# EAGLE design SEV-Remote-Control (EAGLE 7.6.0)

## Sheet 1 of 4
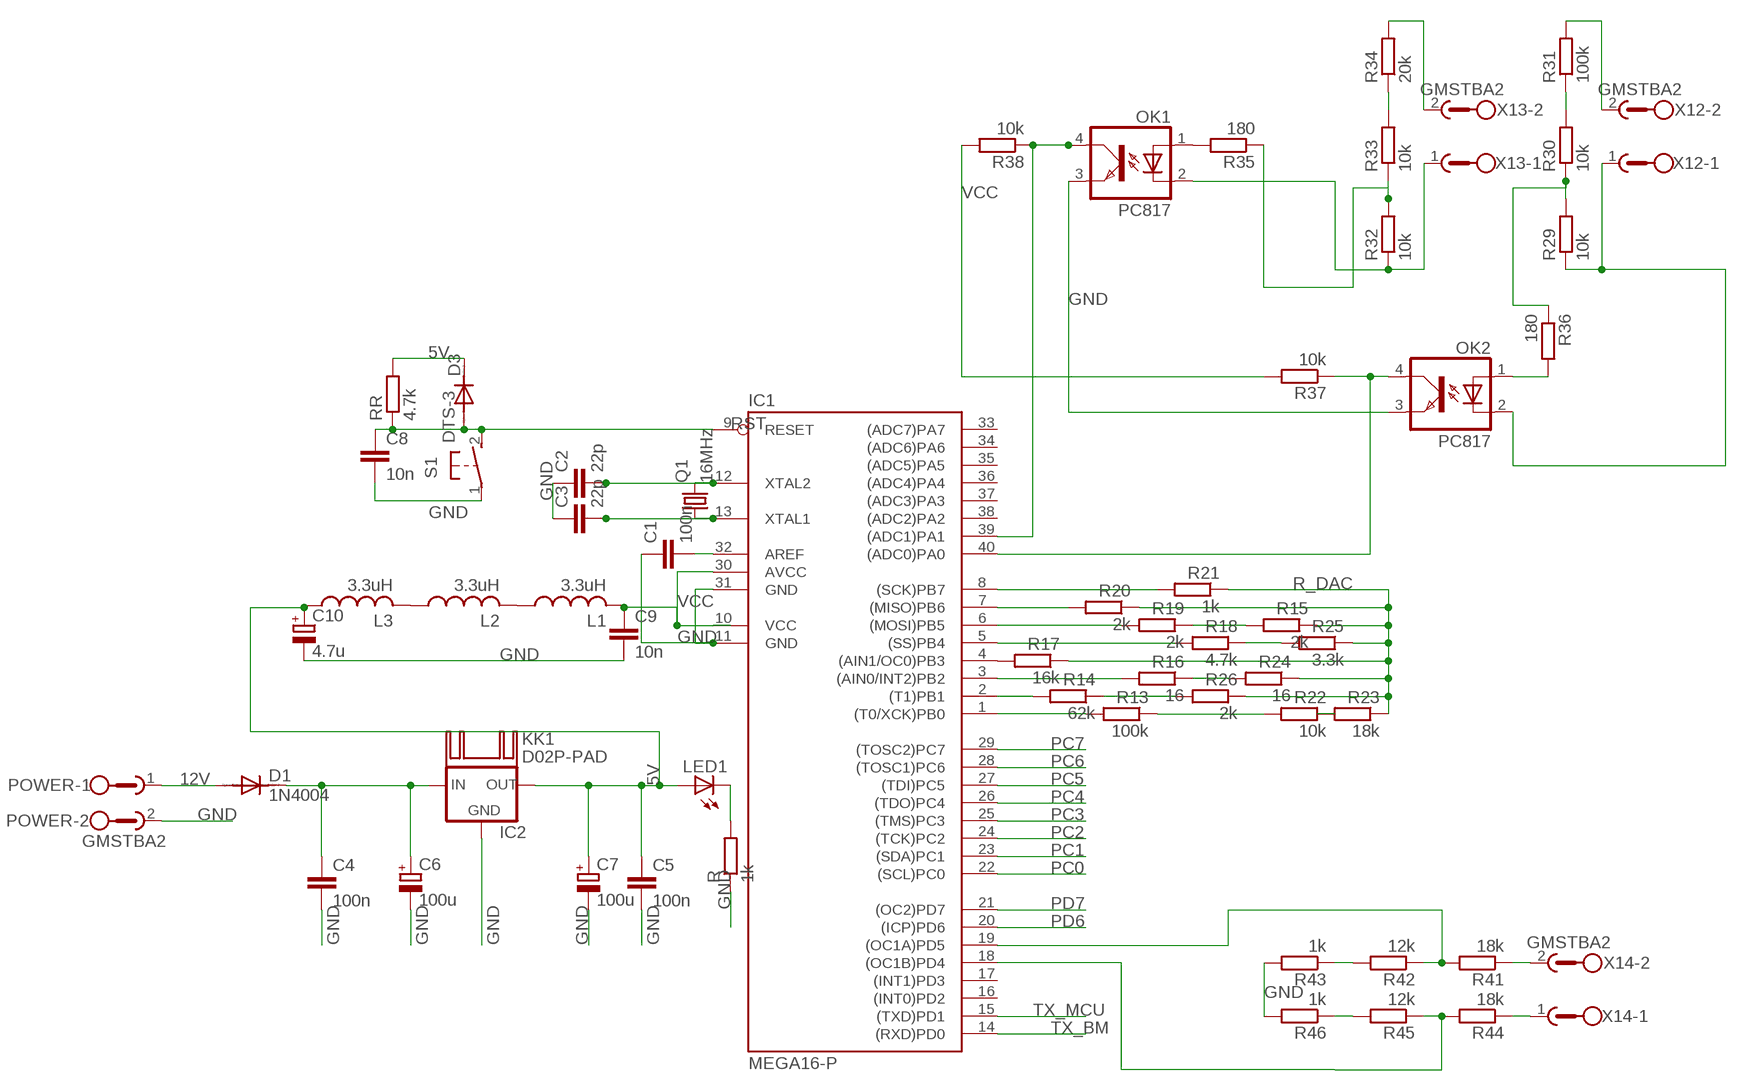
[diagram p0: schematic, sheet 1]

### Parts
C1  100n  C-EU025-025X050  [C025-025X050]
C2  22p  C-EU025-025X050  [C025-025X050]
C3  22p  C-EU025-025X050  [C025-025X050]
C4  100n  C-EU025-025X050  [C025-025X050]
C5  100n  C-EU025-025X050  [C025-025X050]
C6  100u  CPOL-EUE2.5-6  [E2,5-6]
C7  100u  CPOL-EUE2.5-6  [E2,5-6]
C8  10n  C-EU025-025X050  [C025-025X050]
C9  10n  C-EU025-025X050  [C025-025X050]
C10  4.7u  CPOL-EUE2.5-6  [E2,5-6]
D1  1N4004  [DO41-10]
D3  1N4148DO35-10  [DO35-10]
IC1  MEGA16-P  [DIL40]
IC2  78XXS  [78XXS]
KK1  D02P-PAD  [D02PA-PAD]
L1  3.3uH  L-US0207/7  [0207/7]
L2  3.3uH  L-US0207/7  [0207/7]
L3  3.3uH  L-US0207/7  [0207/7]
LED1  LED5MM  [LED5MM]
OK1  PC817  [DIL04]
OK2  PC817  [DIL04]
POWER  GMSTBA2  [GMSTBA2]
Q1  16MHz  CRYSTALHC49S  [HC49/S]
R  1k  R-EU_0207/10  [0207/10]
R13  100k  R-EU_0207/10  [0207/10]
R14  62k  R-EU_0207/10  [0207/10]
R15  2k  R-EU_0207/10  [0207/10]
R16  16  R-EU_0207/10  [0207/10]
R17  16k  R-EU_0207/10  [0207/10]
R18  4.7k  R-EU_0207/10  [0207/10]
R19  2k  R-EU_0207/10  [0207/10]
R20  2k  R-EU_0207/10  [0207/10]
R21  1k  R-EU_0207/10  [0207/10]
R22  10k  R-EU_0207/10  [0207/10]
R23  18k  R-EU_0207/10  [0207/10]
R24  16  R-EU_0207/10  [0207/10]
R25  3.3k  R-EU_0207/10  [0207/10]
R26  2k  R-EU_0207/10  [0207/10]
R29  10k  R-EU_0207/10  [0207/10]
R30  10k  R-EU_0207/10  [0207/10]
R31  100k  R-EU_0207/10  [0207/10]
R32  10k  R-EU_0207/10  [0207/10]
R33  10k  R-EU_0207/10  [0207/10]
R34  20k  R-EU_0207/10  [0207/10]
R35  180  R-EU_0207/10  [0207/10]
R36  180  R-EU_0207/10  [0207/10]
R37  10k  R-EU_0207/10  [0207/10]
R38  10k  R-EU_0207/10  [0207/10]
R41  18k  R-EU_0207/10  [0207/10]
R42  12k  R-EU_0207/10  [0207/10]
R43  1k  R-EU_0207/10  [0207/10]
R44  18k  R-EU_0207/10  [0207/10]
R45  12k  R-EU_0207/10  [0207/10]
R46  1k  R-EU_0207/10  [0207/10]
RR  4.7k  R-EU_0207/10  [0207/10]
S1  DTS-3  [DTS-3]
X12  GMSTBA2  [GMSTBA2]
X13  GMSTBA2  [GMSTBA2]
X14  GMSTBA2  [GMSTBA2]

### Nets
5V: C5.1 C7.+ C10.+ D3.C IC2.OUT L3.1 LED1.A RR.2
12V: D1.A POWER.1 ; also sheet 3
GND: C1.1 C2.1 C3.1 C4.2 C5.2 C6.- C7.- C8.2 C9.2 C10.- IC1.11(GND) IC1.31(GND) IC2.GND OK1.3(EMIT) OK2.3(EMIT) POWER.2 R43.2 R46.2 R.1 S1.1 ; also sheet 2,3,4
IN: C4.1 C6.+ D1.C IC2.IN
N$3: R15.2 R19.1
N$6: R13.1 R22.2
N$8: LED1.K(C) R.2
N$9: C2.2 IC1.12(XTAL2) Q1.2
N$10: R22.1 R23.2
N$12: C1.2 IC1.32(AREF)
N$13: R16.1 R24.2
N$15: C3.2 IC1.13(XTAL1) Q1.1
N$16: R18.1 R25.2
N$18: R14.1 R26.2
N$20: L1.1 L2.2
N$22: L2.1 L3.2
N$43: R29.2 R30.1 R36.1
N$45: R30.2 R31.1
N$46: R31.2 X12.2
N$47: IC1.40((ADC0)PA0) OK2.4(COL) R37.1
N$49: OK1.1(A) R35.2
N$51: R33.2 R34.1
N$52: R34.2 X13.2
N$53: OK1.2(C) R32.1 X13.1
N$54: R32.2 R33.1 R35.1
N$55: OK2.1(A) R36.2
N$56: IC1.2((T1)PB1) R14.2
N$57: OK2.2(C) R29.1 X12.1
N$58: IC1.39((ADC1)PA1) OK1.4(COL) R38.1
N$59: R44.1 X14.1
N$60: IC1.1((T0/XCK)PB0) R13.2
N$61: IC1.3((AIN0/INT2)PB2) R16.2
N$62: IC1.4((AIN1/OC0)PB3) R17.2
N$63: IC1.5((SS)PB4) R18.2
N$64: IC1.6((MOSI)PB5) R19.2
N$65: IC1.7((MISO)PB6) R20.2
N$66: IC1.8((SCK)PB7) R21.2
N$67: R41.1 X14.2
N$69: IC1.19((OC1A)PD5) R41.2 R42.1
N$71: IC1.18((OC1B)PD4) R44.2 R45.1
N$72: R42.2 R43.1
N$73: R45.2 R46.1
PC0: IC1.22((SCL)PC0) ; also sheet 3
PC1: IC1.23((SDA)PC1) ; also sheet 3
PC2: IC1.24((TCK)PC2) ; also sheet 3
PC3: IC1.25((TMS)PC3) ; also sheet 3
PC4: IC1.26((TDO)PC4) ; also sheet 3
PC5: IC1.27((TDI)PC5) ; also sheet 3
PC6: IC1.28((TOSC1)PC6) ; also sheet 3
PC7: IC1.29((TOSC2)PC7) ; also sheet 3
PD6: IC1.20((ICP)PD6) ; also sheet 3
PD7: IC1.21((OC2)PD7) ; also sheet 3
R_DAC: R15.1 R17.1 R20.1 R21.1 R23.1 R24.1 R25.1 R26.1 ; also sheet 2
RST: C8.1 D3.A IC1.9(RESET) RR.1 S1.2
TX_BM: IC1.14((RXD)PD0) ; also sheet 4
TX_MCU: IC1.15((TXD)PD1) ; also sheet 4
VCC: C9.1 IC1.10(VCC) IC1.30(AVCC) L1.2 R37.2 R38.2 ; also sheet 4
Unconnected: IC1.16((INT0)PD2) IC1.17((INT1)PD3) IC1.33((ADC7)PA7) IC1.34((ADC6)PA6) IC1.35((ADC5)PA5) IC1.36((ADC4)PA4) IC1.37((ADC3)PA3) IC1.38((ADC2)PA2) KK1.B(K)

## Sheet 2 of 4
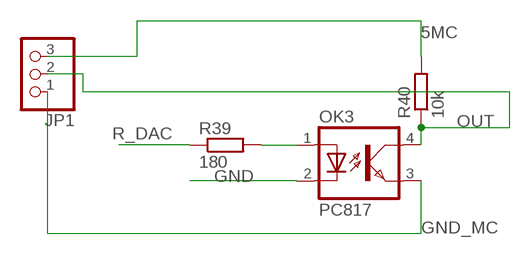
[diagram p1: schematic, sheet 2]

### Parts
JP1  PINHD-1X3  [1X03]
OK3  PC817  [DIL04]
R39  180  R-EU_0207/10  [0207/10]
R40  10k  R-EU_0207/10  [0207/10]

### Nets
5MC: JP1.3 R40.2
GND: OK3.2(C) ; also sheet 1,3,4
GND_MC: JP1.1 OK3.3(EMIT)
N$24: OK3.1(A) R39.2
OUT: JP1.2 OK3.4(COL) R40.1
R_DAC: R39.1 ; also sheet 1

## Sheet 3 of 4
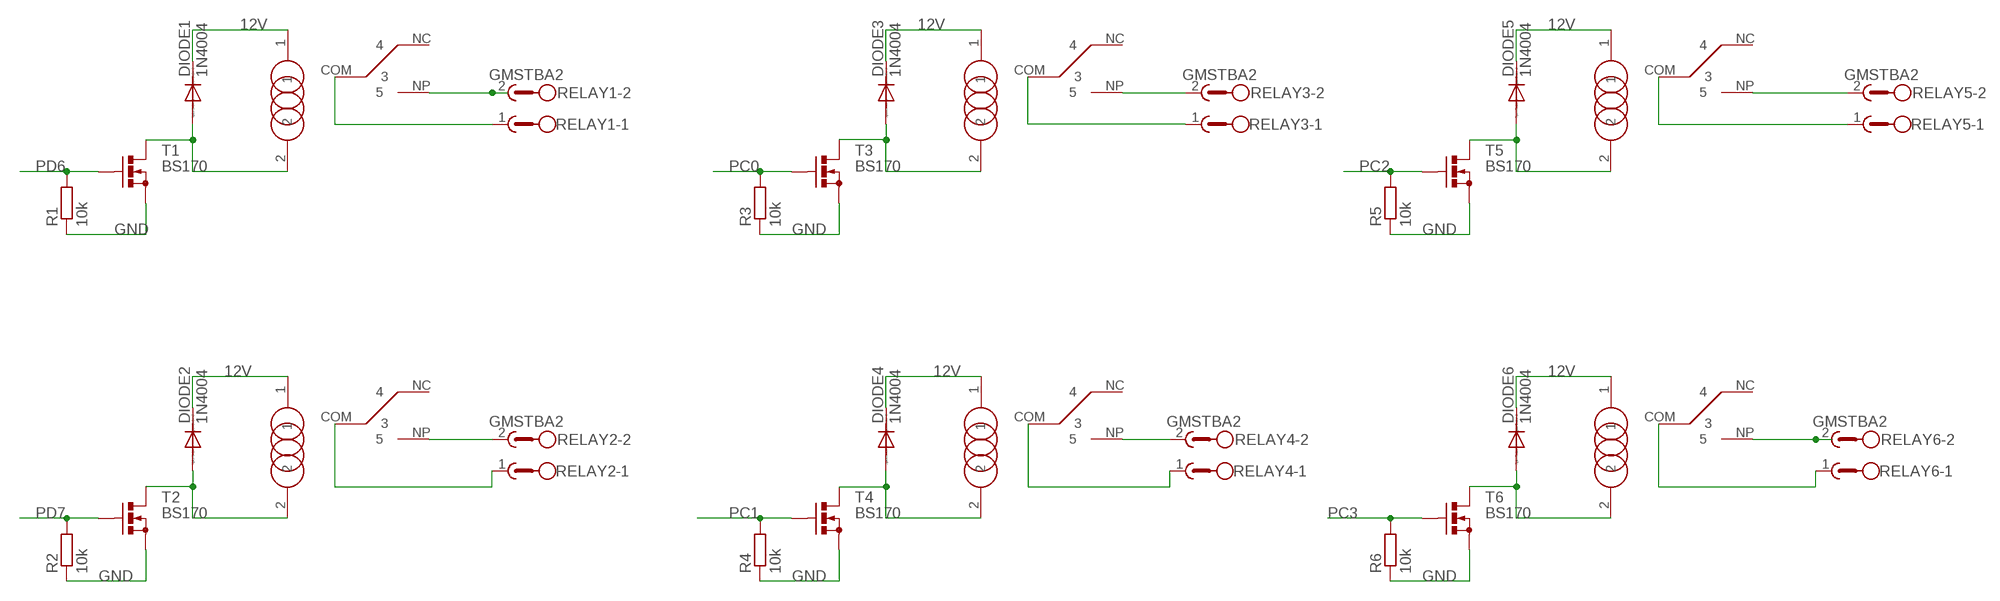
[diagram p2: schematic, sheet 3, part 1 of 2]
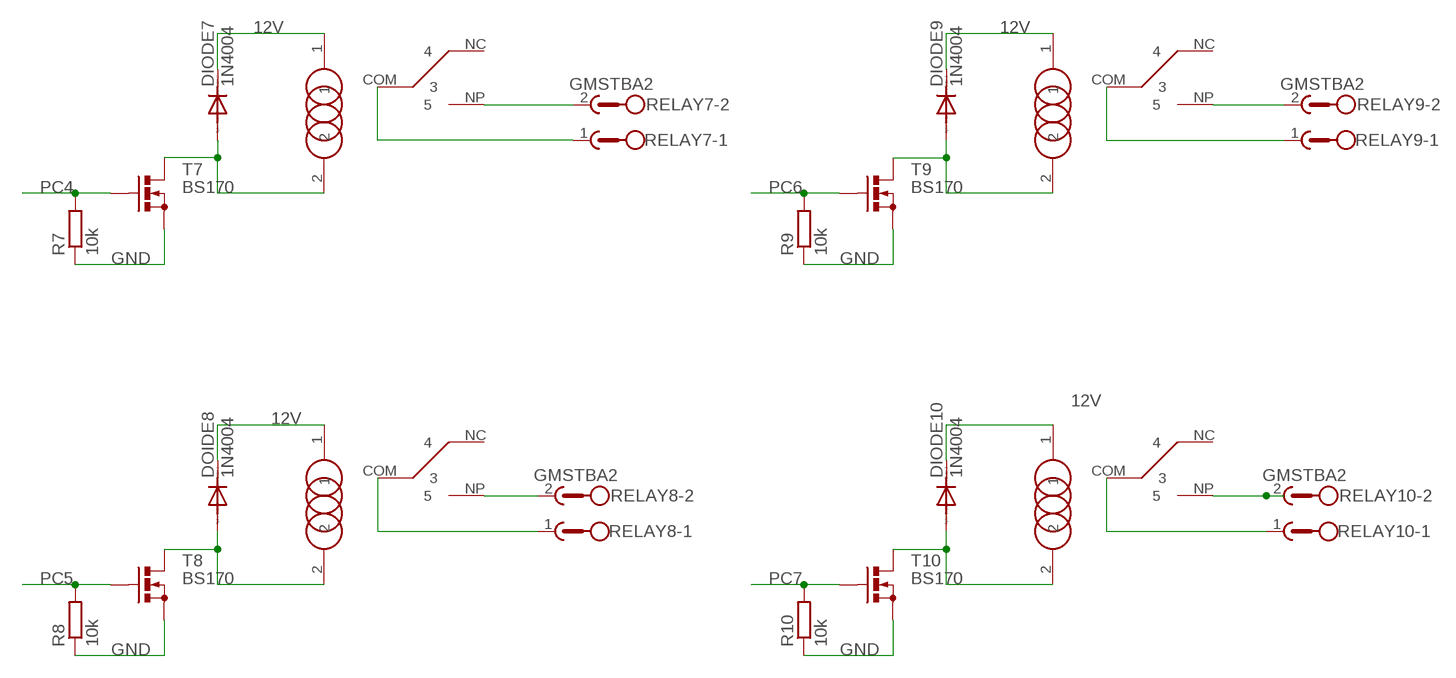
[diagram p3: schematic, sheet 3, part 2 of 2]

### Parts
DIODE1  1N4004  [DO41-10]
DIODE2  1N4004  [DO41-10]
DIODE3  1N4004  [DO41-10]
DIODE4  1N4004  [DO41-10]
DIODE5  1N4004  [DO41-10]
DIODE6  1N4004  [DO41-10]
DIODE7  1N4004  [DO41-10]
DIODE9  1N4004  [DO41-10]
DIODE10  1N4004  [DO41-10]
DOIDE8  1N4004  [DO41-10]
R1  10k  R-EU_0207/10  [0207/10]
R2  10k  R-EU_0207/10  [0207/10]
R3  10k  R-EU_0207/10  [0207/10]
R4  10k  R-EU_0207/10  [0207/10]
R5  10k  R-EU_0207/10  [0207/10]
R6  10k  R-EU_0207/10  [0207/10]
R7  10k  R-EU_0207/10  [0207/10]
R8  10k  R-EU_0207/10  [0207/10]
R9  10k  R-EU_0207/10  [0207/10]
R10  10k  R-EU_0207/10  [0207/10]
REL3  RELAY  [RELAY]
RELAY1  GMSTBA2  [GMSTBA2]
RELAY2  GMSTBA2  [GMSTBA2]
RELAY3  GMSTBA2  [GMSTBA2]
RELAY4  GMSTBA2  [GMSTBA2]
RELAY5  GMSTBA2  [GMSTBA2]
RELAY6  GMSTBA2  [GMSTBA2]
RELAY7  GMSTBA2  [GMSTBA2]
RELAY8  GMSTBA2  [GMSTBA2]
RELAY9  GMSTBA2  [GMSTBA2]
RELAY10  GMSTBA2  [GMSTBA2]
T1  BS170  [SOT54E]
T2  BS170  [SOT54E]
T3  BS170  [SOT54E]
T4  BS170  [SOT54E]
T5  BS170  [SOT54E]
T6  BS170  [SOT54E]
T7  BS170  [SOT54E]
T8  BS170  [SOT54E]
T9  BS170  [SOT54E]
T10  BS170  [SOT54E]
U$1  RELAY  [RELAY]
U$2  RELAY  [RELAY]
U$3  RELAY  [RELAY]
U$5  RELAY  [RELAY]
U$6  RELAY  [RELAY]
U$7  RELAY  [RELAY]
U$8  RELAY  [RELAY]
U$9  RELAY  [RELAY]
U$10  RELAY  [RELAY]

### Nets
12V: DIODE1.C DIODE2.C DIODE3.C DIODE4.C DIODE5.C DIODE6.C DIODE7.C DIODE9.C DIODE10.C DOIDE8.C REL3.1 U$1.1 U$2.1 U$3.1 U$5.1 U$6.1 U$7.1 U$8.1 U$9.1 U$10.1 ; also sheet 1
COM: RELAY10.1 U$3.COM
COM1: RELAY2.1 U$9.COM
GND: R1.1 R2.1 R3.1 R4.1 R5.1 R6.1 R7.1 R8.1 R9.1 R10.1 T1.S T2.S T3.S T4.S T5.S T6.S T7.S T8.S T9.S T10.S ; also sheet 1,2,4
N$1: REL3.COM RELAY3.1
N$4: DIODE3.A REL3.2 T3.D
N$5: RELAY8.1 U$1.COM
N$7: DOIDE8.A T8.D U$1.2
N$11: DIODE9.A T9.D U$2.2
N$14: RELAY9.2 U$2.NP
N$17: RELAY6.2 U$8.NP
N$19: DIODE10.A T10.D U$3.2
N$23: DIODE6.A T6.D U$8.2
N$26: DIODE2.A T2.D U$9.2
N$27: RELAY7.2 U$10.NP
N$28: REL3.NP RELAY3.2
N$29: DIODE7.A T7.D U$10.2
N$31: RELAY4.1 U$5.COM
N$32: DIODE4.A T4.D U$5.2
N$33: RELAY9.1 U$2.COM
N$34: RELAY5.1 U$6.COM
N$35: RELAY8.2 U$1.NP
N$36: RELAY4.2 U$5.NP
N$38: RELAY6.1 U$8.COM
N$39: RELAY1.1 U$7.COM
N$40: RELAY7.1 U$10.COM
N$42: DIODE5.A T5.D U$6.2
N$44: RELAY5.2 U$6.NP
N$48: DIODE1.A T1.D U$7.2
N$50: RELAY1.2 U$7.NP
NP1: RELAY2.2 U$9.NP
PC0: R3.2 T3.G ; also sheet 1
PC1: R4.2 T4.G ; also sheet 1
PC2: R5.2 T5.G ; also sheet 1
PC3: R6.2 T6.G ; also sheet 1
PC4: R7.2 T7.G ; also sheet 1
PC5: R8.2 T8.G ; also sheet 1
PC6: R9.2 T9.G ; also sheet 1
PC7: R10.2 T10.G ; also sheet 1
PD6: R1.2 T1.G ; also sheet 1
PD7: R2.2 T2.G ; also sheet 1
RELAY6: RELAY10.2 U$3.NP
Unconnected: REL3.NC U$1.NC U$2.NC U$3.NC U$5.NC U$6.NC U$7.NC U$8.NC U$9.NC U$10.NC

## Sheet 4 of 4
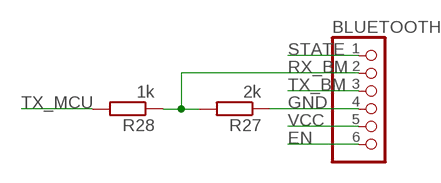
[diagram p4: schematic, sheet 4]

### Parts
BLUETOOTH  PINHD-1X6  [1X06]
R27  2k  R-EU_0207/10  [0207/10]
R28  1k  R-EU_0207/10  [0207/10]

### Nets
EN: BLUETOOTH.6
GND: BLUETOOTH.4 R27.1 ; also sheet 1,2,3
RX_BM: BLUETOOTH.2 R27.2 R28.1
STATE: BLUETOOTH.1
TX_BM: BLUETOOTH.3 ; also sheet 1
TX_MCU: R28.2 ; also sheet 1
VCC: BLUETOOTH.5 ; also sheet 1

## Library data of the parts
BLUETOOTH = pinhead:PINHD-1X6: PIN HEADER
C1-C5 C8 C9 = rcl:C-EU: CAPACITOR, European symbol
C6 C7 C10 = rcl:CPOL-EU: POLARIZED CAPACITOR, European symbol
D1 DIODE1-DIODE7 DIODE9 DIODE10 DOIDE8 = diode:1N4004: DIODE general purpose rectifier, 1 A
D3 = diode:1N4148: DIODE high speed (Philips)
IC1 = atmel:MEGA16-P: MICROCONTROLLER 16 Kbytes FLASH 1 kbytes SRAM 512 bytes EEPROM USART 8-channel 10 bit ADC Source: avr.lbr; MPN: ATMEGA16-16PU; OC_FARNELL: 9171142; OC_NEWARK: 01M6885
IC2 = v-reg:78XXS: VOLTAGE REGULATOR
JP1 = pinhead:PINHD-1X3: PIN HEADER
KK1 = heatsink:D02P-PAD: HEATSINK distributor Schukat
L1-L3 = rcl:L-US: INDUCTOR, American symbol
LED1 = led:LED: LED OSRAM: - CHIPLED LG R971, LG N971, LY N971, LG Q971, LY Q971, LO R971, LY R971 LH N974, LH R974 LS Q976, LO Q976, LY Q976 LO Q996 - Hyper CHIPLED LW Q18S LB Q993, LB Q99A, LB R99A - SideLED LS A670, LO A670, LY A670, LG A670, LP A670 LB A673, LV A673, LT A673, LW A673 LH A674 LY A675 LS A676, LA A676, LO A676, LY A676, LW A676 LS A679, LY A679, LG A679 - Hyper Micro SIDELED® LS Y876, LA Y876, LO Y876, LY Y876 LT Y87S - SmartLED LW L88C, LW L88S LB L89C, LB L89S, LG L890 LS L89K, LO L89K, LY L89K LS L896, LA L896, LO L896, LY L896 - TOPLED LS T670, LO T670, LY T670, LG T670, LP T670 LSG T670, LSP T670, LSY T670, LOP T670, LYG T670 LG T671, LOG T671, LSG T671 LB T673, LV T673, LT T673, LW T673 LH T674 LS T676, LA T676, LO T676, LY T676, LB T676, LH T676, LSB T676, LW T676 LB T67C, LV T67C, LT T67C, LS T67K, LO T67K, LY T67K, LW E67C LS E67B, LA E67B, LO E67B, LY E67B, LB E67C, LV E67C, LT E67C LW T67C LS T679, LY T679, LG T679 LS T770, LO T770, LY T770, LG T770, LP T770 LB T773, LV T773, LT T773, LW T773 LH T774 LS E675, LA E675, LY E675, LS T675 LS T776, LA T776, LO T776, LY T776, LB T776 LHGB T686 LT T68C, LB T68C - Hyper Mini TOPLED® LB M676 - Mini TOPLED Santana® LG M470 LS M47K, LO M47K, LY M47K Source: http://www.osram.convergy.de LUXEON: - LUMILED® LXK2-PW12-R00, LXK2-PW12-S00, LXK2-PW14-U00, LXK2-PW14-V00 LXK2-PM12-R00, LXK2-PM12-S00, LXK2-PM14-U00 LXK2-PE12-Q00, LXK2-PE12-R00, LXK2-PE12-S00, LXK2-PE14-T00, LXK2-PE14-U00 LXK2-PB12-K00, LXK2-PB12-L00, LXK2-PB12-M00, LXK2-PB14-N00, LXK2-PB14-P00, LXK2-PB14-Q00 LXK2-PR12-L00, LXK2-PR12-M00, LXK2-PR14-Q00, LXK2-PR14-R00 LXK2-PD12-Q00, LXK2-PD12-R00, LXK2-PD12-S00 LXK2-PH12-R00, LXK2-PH12-S00 LXK2-PL12-P00, LXK2-PL12-Q00, LXK2-PL12-R00 Source: www.luxeon.com KINGBRIGHT: KA-3528ASYC Source: www.kingbright.com
OK1-OK3 = optocoupler:PC817: SHARP OPTO COUPLER; MPN: PC817X4J000F; OC_FARNELL: 9707727; OC_NEWARK: 97K7059
POWER RELAY1-RELAY10 X12-X14 = con-phoenix-762:GMSTBA2: PHOENIX; MF: FARNELL; MPN: 1757242; OC_FARNELL: 3705171; OC_NEWARK: 71C4161
Q1 = crystal:CRYSTAL: CRYSTAL; OC_FARNELL: 1667008; OC_NEWARK: unknown
R R1-R10 R13-R46 RR = rcl:R-EU_: RESISTOR, European symbol
REL3 U$1-U$3 U$5-U$10 = relaye:RELAY
S1 = switch-tact:DTS-3
T1-T10 = transistor-small-signal:BS170: N-CHANNEL MOS FET

## Net classes
0 default: width 1.676 mm, clearance 0.305 mm

## Board
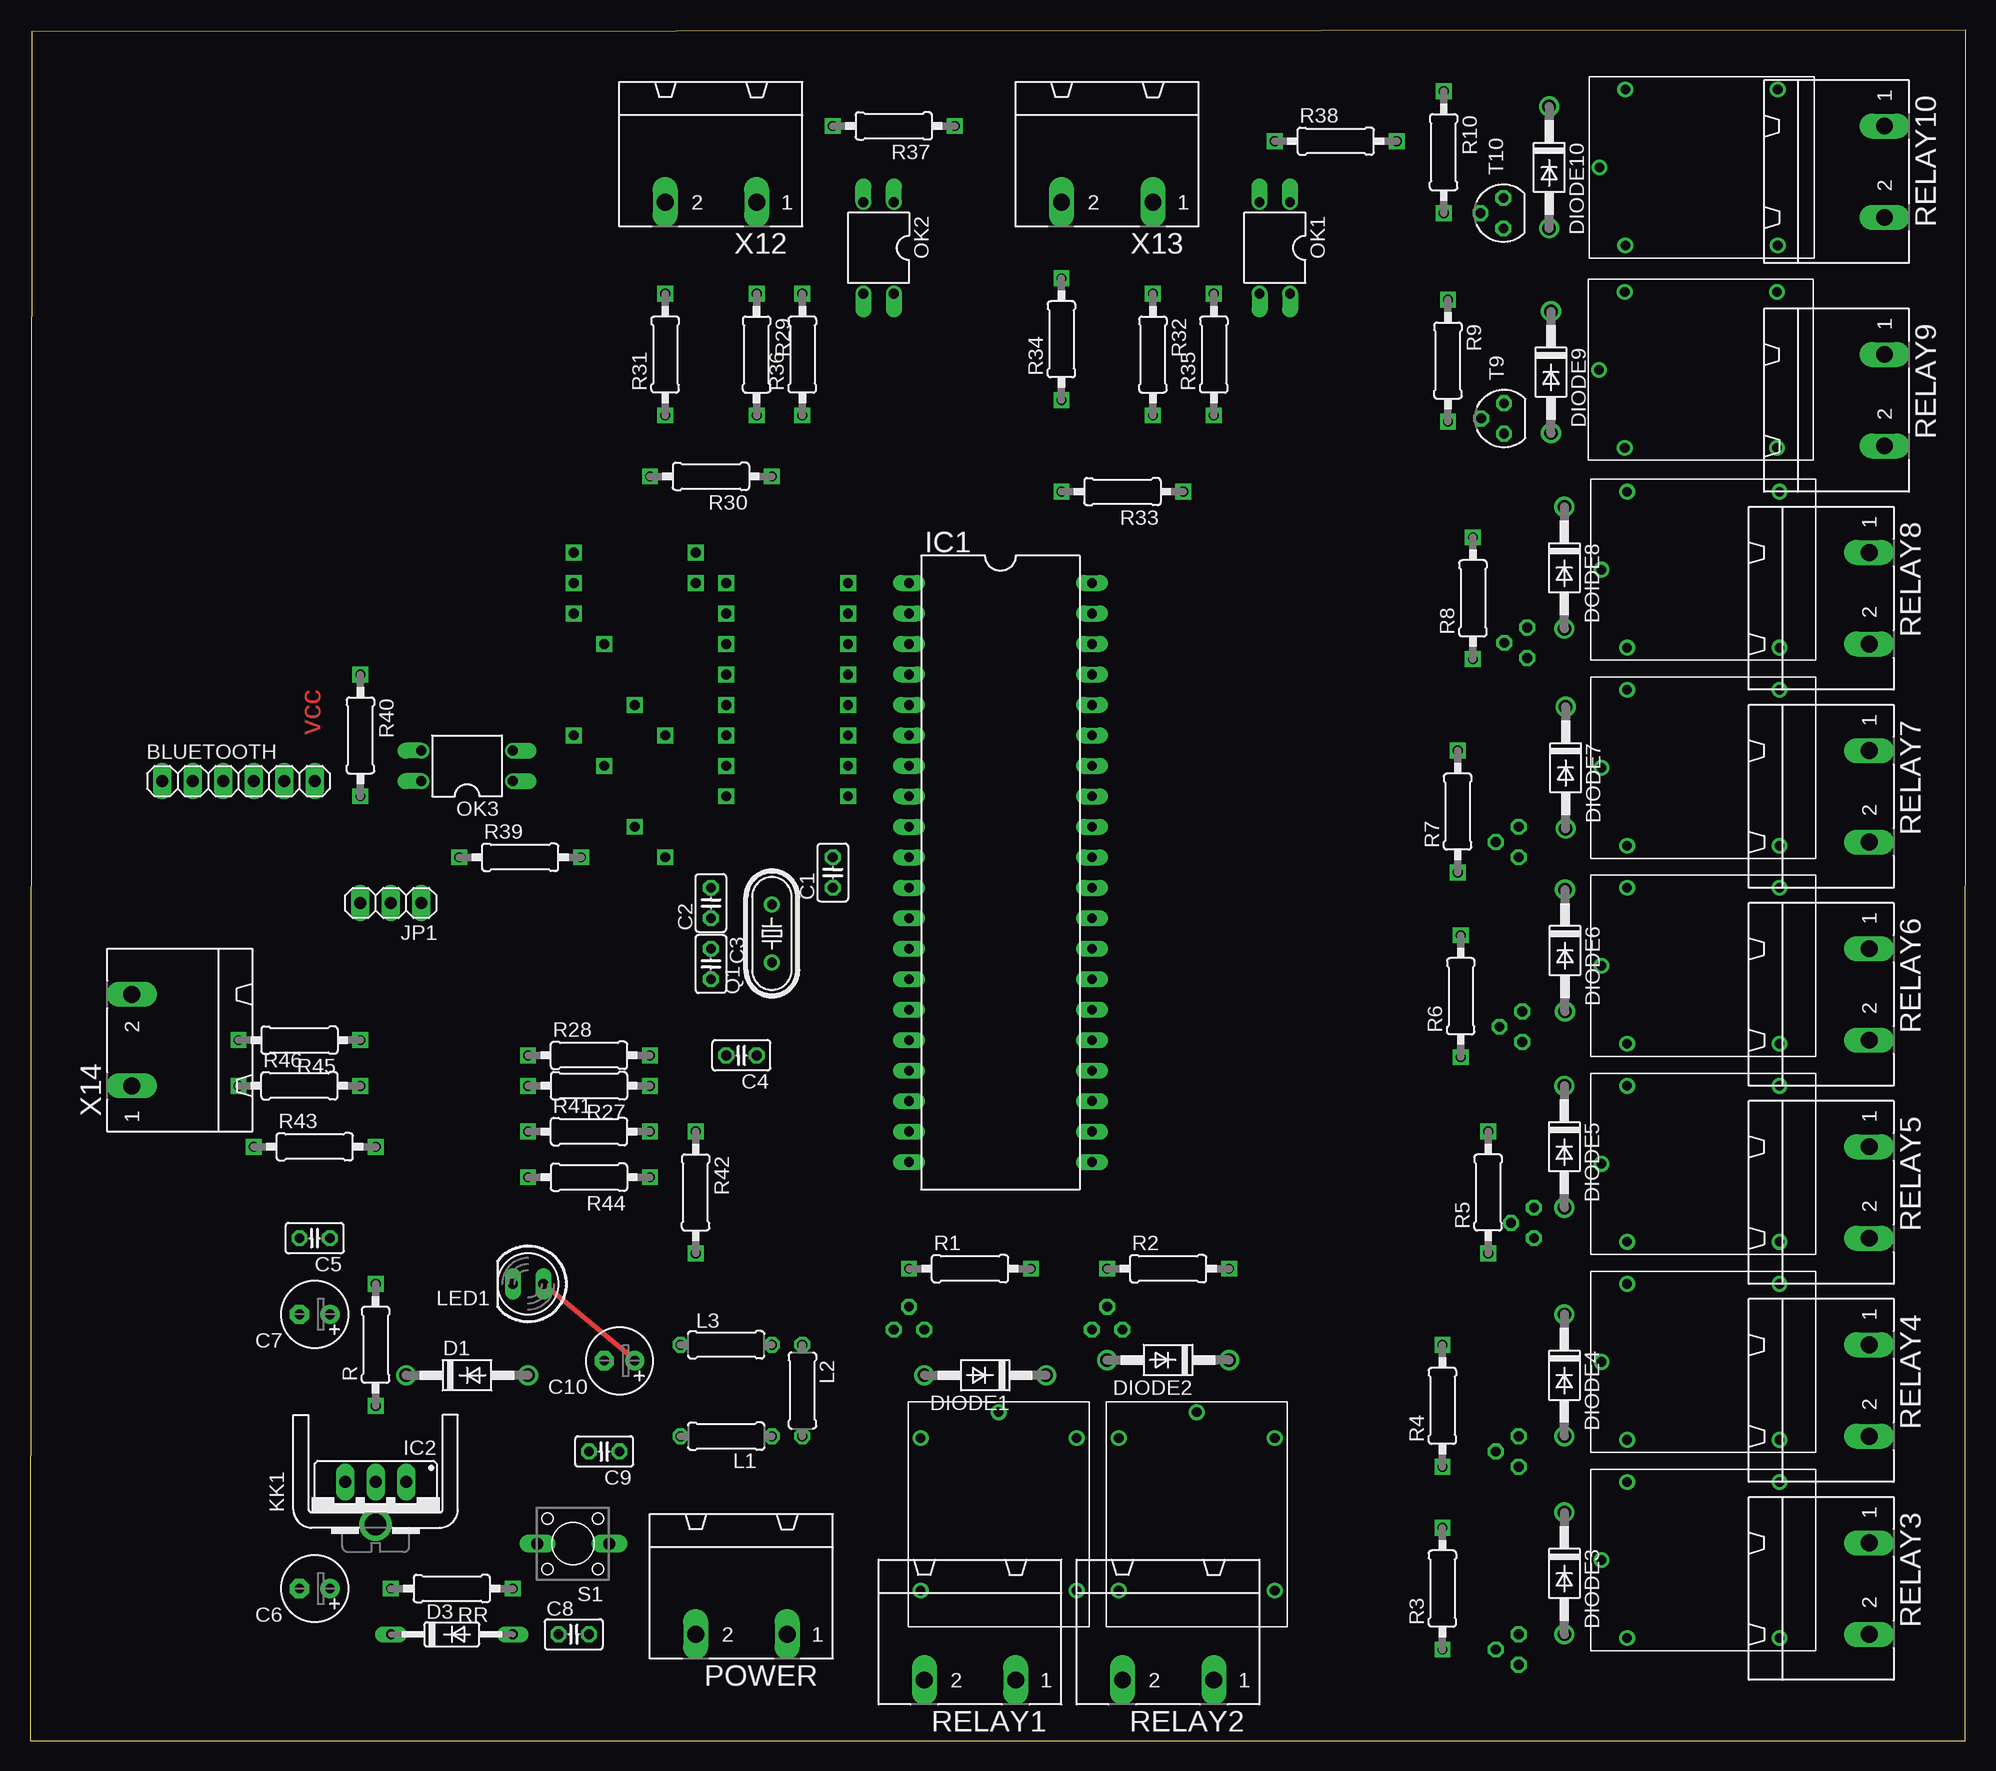
[diagram p5: board, top side]
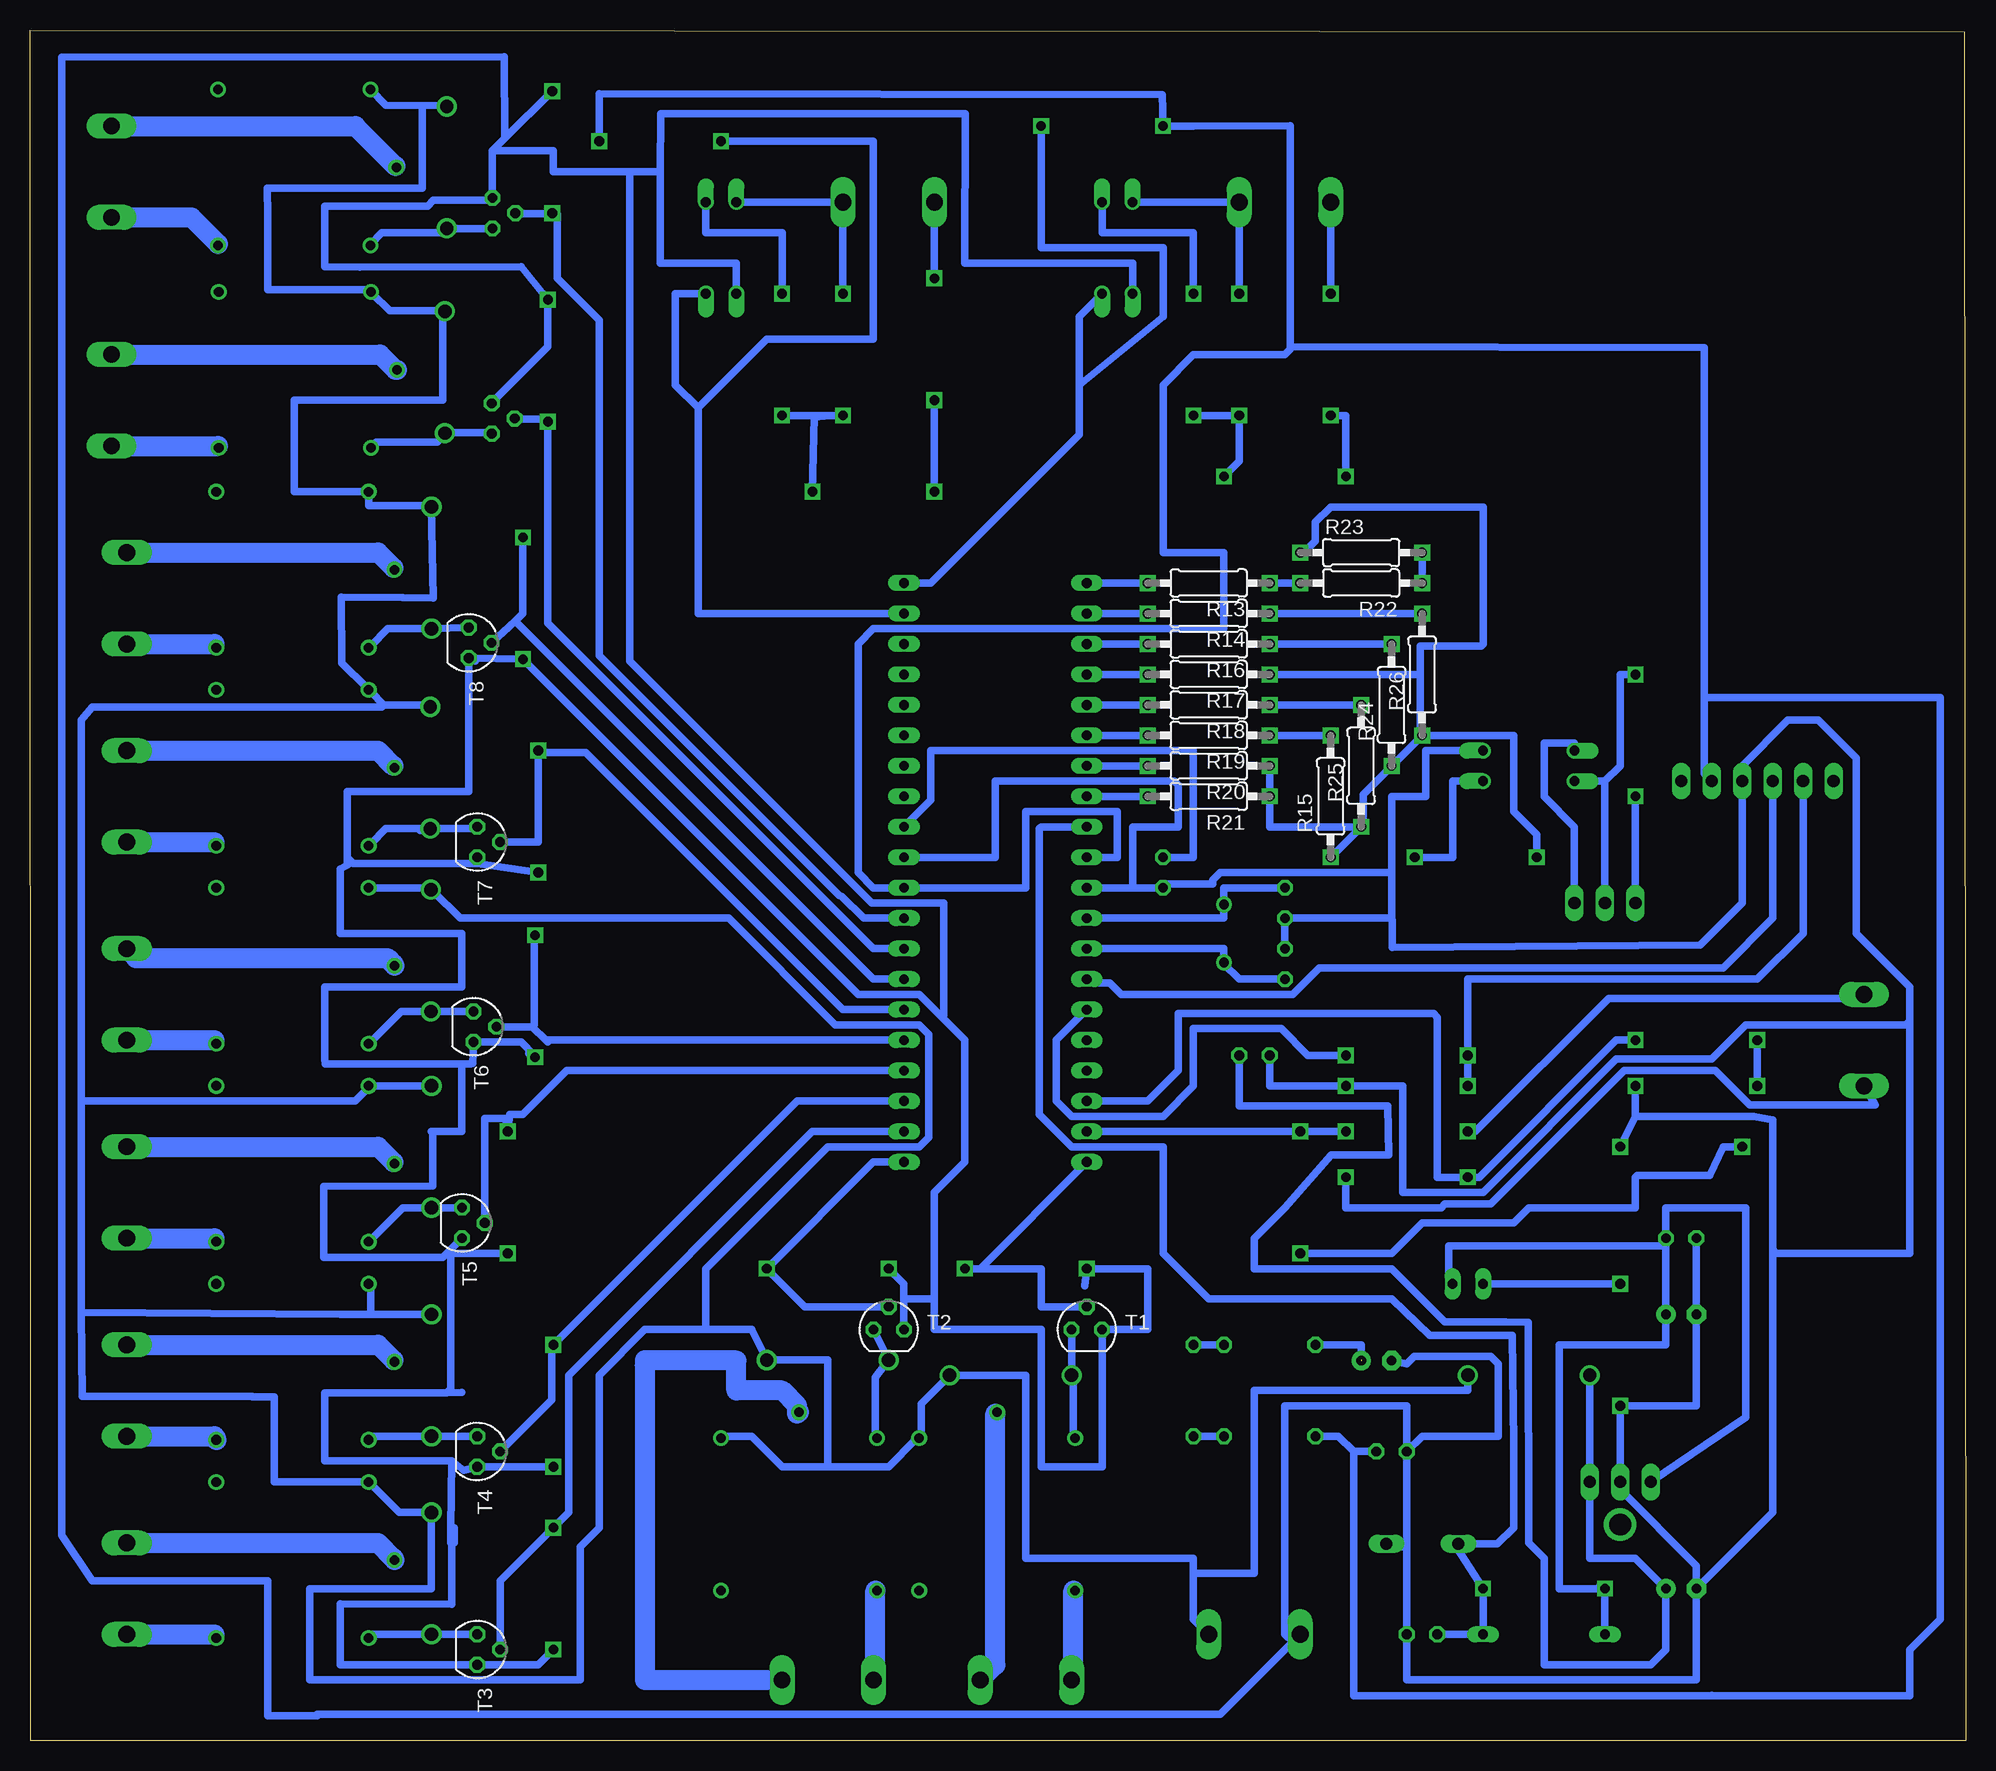
[diagram p6: board, bottom side, seen from below]

Size 161.32 x 142.62 mm. Coordinates in mm from the lower left corner, seen from the top.
Outline: 0,0 161.27,0 161.32,142.62 0.15,142.47 0,0
Copper layers (1*16): Top 0.035mm / dielectric 1.5mm / Bottom 0.035mm
Design rules "default": minimum track width 10mil, minimum drill 24mil, track to track 8mil, track to pad 8mil, pad to pad 8mil, via to via 8mil, smd to smd 8mil, copper to edge 40mil, drill to drill 8mil, minimum pad ring 10mil, minimum via ring 8mil, stop-mask expansion 4mil, vias tented up to drill 0mil, thermal gap 10mil

### Footprints (pad centres in the part's own frame; a part is rotated, then mirrored left to right if it is on the bottom)
1X06 = drill 1.016 long: 1 -6.35,0; 2 -3.81,0; 3 -1.27,0; 4 1.27,0; 5 3.81,0; 6 6.35,0
C025-025X050 = drill 0.813 octagon: 1 -1.27,0; 2 1.27,0
E2,5-6 = drill 0.813 pad 1.6: + -1.27,0 | drill 0.813 pad 1.6 octagon: - 1.27,0
DO41-10 = drill 1.118: A 5.08,0; C -5.08,0
DO35-10 = drill 0.813 long: A 5.08,0; C -5.08,0
DIL40 = drill 0.813 long: 1 -24.13,-7.62; 2 -21.59,-7.62; 3 -19.05,-7.62; 4 -16.51,-7.62; 5 -13.97,-7.62; 6 -11.43,-7.62; 7 -8.89,-7.62; 8 -6.35,-7.62; 9 -3.81,-7.62; 10 -1.27,-7.62; 11 1.27,-7.62; 12 3.81,-7.62; 13 6.35,-7.62; 14 8.89,-7.62; 15 11.43,-7.62; 16 13.97,-7.62; 17 16.51,-7.62; 18 19.05,-7.62; 19 21.59,-7.62; 20 24.13,-7.62; 21 24.13,7.62; 22 21.59,7.62; 23 19.05,7.62; 24 16.51,7.62; 25 13.97,7.62; 26 11.43,7.62; 27 8.89,7.62; 28 6.35,7.62; 29 3.81,7.62; 30 1.27,7.62; 31 -1.27,7.62; 32 -3.81,7.62; 33 -6.35,7.62; 34 -8.89,7.62; 35 -11.43,7.62; 36 -13.97,7.62; 37 -16.51,7.62; 38 -19.05,7.62; 39 -21.59,7.62; 40 -24.13,7.62
78XXS = drill 1.016 long: GND 0,-2.54; IN -2.54,-2.54; OUT 2.54,-2.54
1X03 = drill 1.016 long: 1 -2.54,0; 2 0,0; 3 2.54,0
D02PA-PAD = drill 1.803 pad 2.54: B 0,-1.016
0207/7 = drill 0.813 octagon: 1 -3.81,0; 2 3.81,0
LED5MM = drill 0.813 long: A -1.27,0; K 1.27,0
DIL04 = drill 0.813 offset: 1 -1.27,-3.81; 2 1.27,-3.81; 3 1.27,3.81; 4 -1.27,3.81
GMSTBA2 = drill 1.397 long: 1 -3.81,5.08; 2 3.81,5.08
HC49/S = drill 0.813: 1 -2.413,0; 2 2.413,0
0207/10 = drill 0.813 square: 1 -5.08,0; 2 5.08,0
RELAY = drill 0.8: 1 -6.35,6.5; 2 -6.35,-6.5; COM -8.5,0; NC 6.35,6.5; NP 6.35,-6.5
DTS-3 = drill 1 long: 1 -2.971,0.075; 2 3.029,0.075
SOT54E = drill 0.813 octagon: D -1.27,0; G 0,1.905; S 1.27,0

### Placement (x,y rotation side)
BLUETOOTH  17.37,80.01 0 top
C1  66.9,72.39 90 top
C2  56.74,69.85 90 top
C3  56.74,64.77 270 top
C4  59.28,57.15 180 top
C5  23.72,41.91 180 top
C6  23.72,12.7 180 top
C7  23.72,35.56 180 top
C8  45.31,8.89 0 top
C9  47.85,24.13 180 top
C10  49.12,31.7 180 top
D1  36.42,30.48 0 top
D3  35.15,8.89 0 top
DIODE1  79.6,30.48 180 top
DIODE2  94.84,31.75 180 top
DIODE3  127.86,13.97 270 top
DIODE4  127.86,30.48 270 top
DIODE5  127.86,49.53 270 top
DIODE6  127.91,65.89 270 top
DIODE7  127.97,81.13 270 top
DIODE9  126.75,114.1 270 top
DIODE10  126.59,131.17 270 top
DOIDE8  127.86,97.79 270 top
IC1  80.87,72.39 270 top
IC2  28.8,19.05 180 top
JP1  30.07,69.85 180 top
KK1  28.8,19.05 0 top
L1  58.01,25.4 180 top
L2  64.36,29.21 270 top
L3  58.01,33.02 0 top
LED1  41.5,38.1 180 top
OK1  103.73,124.46 180 top
OK2  70.71,124.46 180 top
OK3  36.42,81.28 90 top
POWER  59.28,13.97 180 top
Q1  61.82,67.31 90 top
R  28.8,33.02 90 top
R1  78.33,39.37 0 top
R2  94.84,39.37 0 top
R3  117.7,12.7 90 top
R4  117.7,27.94 90 top
R5  121.51,45.72 90 top
R6  119.23,62.08 90 top
R7  118.97,77.47 90 top
R8  120.24,95.25 90 top
R9  118.16,115.06 270 top
R10  117.81,132.44 270 top
R13  63.09,96.52 180 bottom
R14  63.09,93.98 180 bottom
R15  52.93,78.74 90 bottom
R16  63.09,91.44 180 bottom
R17  63.09,88.9 180 bottom
R18  63.09,86.36 180 bottom
R19  63.09,83.82 180 bottom
R20  63.09,81.28 180 bottom
R21  63.09,78.74 180 bottom
R22  50.39,96.52 180 bottom
R23  50.39,99.06 0 bottom
R24  47.85,86.36 90 bottom
R25  50.39,81.28 90 bottom
R26  45.31,88.9 90 bottom
R27  46.58,54.61 180 top
R28  46.58,57.15 0 top
R29  60.55,115.57 270 top
R30  56.74,105.41 180 top
R31  52.93,115.57 90 top
R32  93.57,115.57 270 top
R33  91.03,104.14 180 top
R34  85.95,116.84 90 top
R35  98.65,115.57 90 top
R36  64.36,115.57 90 top
R37  71.98,134.62 180 top
R38  108.81,133.35 0 top
R39  40.84,73.66 0 top
R40  27.53,83.82 270 top
R41  46.58,50.8 0 top
R42  55.47,45.72 270 top
R43  23.72,49.53 0 top
R44  46.58,46.99 180 top
R45  22.45,58.42 180 top
R46  22.45,54.61 0 top
REL3  139.45,15.09 0 top
RELAY1  78.33,10.16 180 top
RELAY2  94.84,10.16 180 top
RELAY3  148.18,12.7 270 top
RELAY4  148.18,29.21 270 top
RELAY5  148.18,45.72 270 top
RELAY6  148.18,62.23 270 top
RELAY7  148.18,78.74 270 top
RELAY8  148.18,95.25 270 top
RELAY9  149.45,111.76 270 top
RELAY10  149.45,130.81 270 top
RR  35.15,12.7 180 top
S1  45.31,16.51 180 top
T1  73.25,34.29 0 bottom
T2  89.76,34.29 0 bottom
T3  124.05,7.62 270 bottom
T4  124.05,24.13 270 bottom
T5  125.32,43.18 270 bottom
T6  124.36,59.54 270 bottom
T7  124.05,74.93 270 bottom
T8  124.76,91.54 270 bottom
T9  122.83,110.24 90 top
T10  122.78,127.36 90 top
U$1  139.45,97.64 0 top
U$2  139.24,114.3 0 top
U$3  139.29,131.17 0 top
U$5  139.45,31.6 0 top
U$6  139.45,48.11 0 top
U$7  80.72,18.9 270 top
U$8  139.45,64.62 0 top
U$9  97.23,18.9 270 top
U$10  139.45,81.13 0 top
X12  56.74,133.35 180 top
X13  89.76,133.35 180 top
X14  13.56,58.42 90 top

### Tracks (layer width: path | path; a pad name or v marks a point on that pad's centre or on a via)
5MC
  Bottom 0.61: R40.2 JP1.3 27.53,68.58
5V  (1 unrouted)
  Top 0.406: 50.39,31.75 LED1.A
  Bottom 0.61: D3.C RR.2 30.39,13.02 30.71,12.7 33.88,12.7 33.88,33.02 24.99,33.02 C7.+ 24.99,41.28 | 24.99,41.28 43.09,41.28 43.09,38.42 LED1.A | 24.99,41.28 C5.1 24.99,44.45 18.33,44.45 18.33,26.99 IC2.OUT | L3.1 50.39,33.02 C10.+
12V
  Bottom 0.61: DIODE5.C 132.94,54.61 U$6.1 | DIODE4.C 130.56,35.56 130.57,35.57 132.94,35.57 | 134.37,35.56 135.48,35.57 | 135.48,35.57 157.04,35.71 | 133.26,54.45 U$6.1 | 133.26,38.26 U$5.1 132.94,37.94 132.94,35.57 | 157.04,35.71 156.98,28.73 155.01,28.73 142.79,28.73 142.79,28.7 140.97,28.7 140.97,21.59 140.56,21.59 REL3.1 132.94,21.43 130.56,19.05 DIODE3.C 127.86,12.7 138.02,12.7 138.02,5.08 115.48,5.08 115.48,16.19 113.89,17.78 113.89,30.48 110.08,34.29 105,34.29 | 128.64,136.31 126.59,136.37 DIODE10.C | 128.64,136.31 131.67,136.37 132.94,137.64 U$3.1 | 126.91,119.22 126.75,119.22 DIODE9.C | 126.91,119.22 131.36,119.22 132.78,120.65 U$2.1 133.1,120.97 141.52,120.97 141.52,127.16 141.55,129.41 128.64,129.41 128.64,136.31 | 131.83,86.36 132.94,87.47 U$10.1 133.26,87.79 135.32,89.85 135.38,95.34 130.25,95.29 127.73,95.28 127.88,102.97 | 131.83,86.36 128.02,86.36 DIODE7.C | U$8.1 132.94,71.12 128.02,71.12 DIODE6.C 127.7,70.8 125.48,68.58 103.1,68.58 94.21,59.69 87.22,59.69 86.43,58.9 86.43,50.32 87.22,49.53 94.84,49.53 105,39.37 105,34.29 | 127.88,102.97 DOIDE8.C 127.7,102.71 | 132.94,103.98 U$1.1 | 126.91,119.22 126.91,111.76 139.29,111.76 139.29,104.14 U$1.1 | 133.26,104.3 U$1.1 | 131.83,86.36 131.99,86.2 156.12,86.2 157.04,85.08 157.04,53.34 | 103.57,25.4 U$9.1 103.58,25.4 101.19,25.4 98.65,22.86 94.84,22.86 | 127.88,102.97 133.1,102.97 U$1.1 | 157.04,35.71 157.04,53.34 | 157.04,53.34 134.21,53.34 133.26,54.29 U$6.1 | 105,34.29 101.19,34.29 DIODE2.C 94.84,31.75 94.84,22.86 | 94.84,22.86 89.76,22.86 87.54,25.08 87.38,25.08 U$7.1 87.06,25.4 87.06,28.1 DIODE1.C 78.33,30.48 78.33,15.24 64.36,15.24 64.36,13.97
  Bottom 0.61: 64.36,13.97 64.36,10.16 POWER.1 | 64.36,13.97 59.28,13.97 59.28,29.21 41.5,29.21 D1.A | 132.94,35.57 135.48,35.57 | 132.94,35.56 132.94,35.57
COM
  Bottom 0.61: 130.88,131.29 U$3.COM
  Bottom 1.676: 130.88,131.29 134.21,134.62 RELAY10.1
COM1
  Bottom 0.61: RELAY2.1 99.29,5.72 99.92,5.08
  Bottom 1.676: 99.92,5.08 110.08,5.08 110.08,31.12 109.95,31.72 | U$9.COM 97.38,27.31 97.38,27.94 98.65,29.21 102.46,29.21 102.46,31.72 109.95,31.72 | 109.95,31.72 110.08,31.75
GND
  Bottom 0.61: T8.S R8.1 | 124.21,90.01 T8.S | 124.21,73.82 T7.S 124.05,73.15 | R3.1 118.97,6.35 T3.S 135.48,6.35 135.48,11.43 126.19,11.38 126.19,16.51 | R4.1 T4.S 125.16,22.54 126.17,23.36 | R6.1 119.29,57.15 120.4,58.26 124.21,58.26 T6.S 124.41,56.49 124.61,56.44 125.32,56.44 | 126.59,40.64 126.91,40.32 133.74,40.32 136.86,40.3 136.86,46.22 127.76,46.27 127.76,50.69 127.86,50.8 125.32,50.8 125.32,56.44 | 126.59,40.64 126.43,40.8 | 126.43,40.8 T5.S | 119.77,57.31 R6.1 | 125.32,29.05 126.59,29.04 | 126.43,40.8 126.28,40.64 126.28,29.35 126.59,29.04 | 126.17,23.36 126.26,17.78 | 126.26,17.78 126.28,16.51 | T9.S 122.78,111.6 118.18,116.2 118.18,120.02 R9.1 118.34,120.33 120.39,122.89 133.83,122.84 136.75,122.87 136.75,127.95 128.18,127.95 127.7,128.43 122.94,128.43 T10.S 122.78,132.56 | 122.78,132.56 121.75,133.59 | 121.75,133.59 117.86,137.48 R10.1 117.54,137.64 | 118.97,56.83 R6.1 | 88.49,36.83 88.49,38.1 R2.1 | 88.49,36.83 T2.S | 88.49,36.83 85.95,36.83 | 85.95,36.83 85.99,36.53 85.95,36.53 85.95,45.72 83.41,48.26 83.41,58.42 85.32,60.33 | 73.41,37.94 R1.1 68.17,39.37 68.17,34.29 T1.S 71.98,22.86 77.06,22.86 77.06,34.29 85.95,34.29 85.95,36.83 | 120.08,90.01 R8.1 | C5.2 C7.- 22.45,27.94 R.1 IC2.GND 28.8,20.96 22.45,14.61 C6.- | 46.58,16.19 C8.2 46.58,5.08 22.45,5.08 C6.- | 46.58,16.19 48.17,16.19 S1.1 | 46.58,16.19 C9.2 | C10.- 46.58,31.43 45.95,32.07 39.6,32.07 38.96,31.43 38.96,25.4 45.31,25.4 C9.2 | C9.2 46.58,27.94 56.74,27.94 56.74,8.89 56.11,8.26 | 56.11,8.26 62.14,2.22 137.39,2.22 137.39,2.08 141.53,2.08 141.53,13.34 156.12,13.34 158.66,17.15 158.66,140.34 121.79,140.39 121.75,133.59
  Bottom 0.61: 56.11,8.26 POWER.2 | R7.1 124.05,73.15 | T8.S 124.76,79.15 134.87,79.15 134.87,73.66 | R46.2 27.53,52.07 | 27.53,52.07 R43.2 | C4.2 58.01,54.61 R27.1 46.94,54.61 46.94,45.72 40.23,45.72 29.12,56.83 21.18,56.83 18.33,59.69 4.99,59.69 | C6.- 16.1,19.05 16.1,40.96 | 16.1,40.96 16.1,51.75 17.69,52.07 27.53,52.07 | 22.14,12.38 C6.- | BLUETOOTH.4 18.64,80.33 | C3.1 C2.1 47.85,68.58 | OK3.2 45,82.55 45,78.74 47.85,78.74 47.85,72.39 | BLUETOOTH.4 18.64,69.85 22.14,66.36 47.82,66.15 47.82,68.38 47.85,68.58 | OK1.3 102.46,123.19 108.81,123.19 108.81,130.81 | 108.81,130.81 108.76,135.64 83.36,135.64 83.41,123.19 69.44,123.19 OK2.3 | 122.78,132.56 117.7,132.56 117.7,130.81 111.35,130.81 | 111.35,130.81 108.81,130.81 | 134.87,73.66 134.87,73.05 134.57,73.2 135.48,72.7 135.48,67.31 125.32,67.31 125.32,62.84 136.75,62.84 136.75,56.9 136.7,56.44 125.32,56.44 | 124.05,73.15 134.37,73.15 134.87,73.66 | R5.1 126.59,40.64 | 126.59,29.04 136.76,29.04 136.76,23.36 126.17,23.36 | 126.19,16.51 126.19,16.66 | 126.19,16.51 125.96,16.51 125.96,17.78 126.26,17.78 | R8.1 92.3,62.23 87.22,62.23 85.32,60.33 | 85.32,60.33 85.16,60.48 85.16,69.87 87.22,69.85 91.19,69.85 111.35,90.02 111.35,130.81 | 47.85,68.58 47.85,72.39 | 4.99,59.69 4.83,59.85 4.67,59.69 | 47.85,72.39 62.14,72.39 62.78,71.75 62.78,71.44 66.9,71.44 C1.1 69.44,71.12 | 69.44,71.12 69.44,76.2 65.63,76.2 65.63,79.69 65.95,80.01 80.87,80.01 80.87,73.66 IC1.31 | 69.44,71.12 IC1.11 | 16.1,40.96 15.79,40.64 4.67,40.64 4.67,59.69 | 4.67,59.69 4.99,59.69 | BLUETOOTH.4 18.64,81.28 14.83,85.09 12.29,85.09 9.12,81.92 9.12,67.31 4.67,62.87 4.67,59.69
GND_MC
  Bottom 0.61: OK3.3 32.61,83.19 35.15,83.19 35.15,78.74 32.61,76.2 JP1.1
IN
  Bottom 0.61: D1.C IC2.IN 31.34,15.24 27.53,15.24 C6.+ 24.99,7.62 26.26,6.35 35.15,6.35 35.15,15.24 36.42,16.51 36.47,34.9 38.33,34.93 43.41,34.93 47.85,39.37 59.28,39.37 59.28,41.91 56.74,44.45 52.88,48.87 48.11,48.87 48.16,52.93 60.55,52.93 C4.1
N$1
  Bottom 1.676: RELAY3.1 132.31,16.51 131.04,15.24 REL3.COM
N$3
  Bottom 0.61: R19.1 R15.2
N$4
  Bottom 0.61: REL3.2 132.94,8.73 132.78,8.89 DIODE3.A T3.D
N$5
  Bottom 0.61: 131.04,97.79 U$1.COM
  Bottom 1.676: 131.04,97.79 132.31,99.06 RELAY8.1
N$6
  Bottom 0.61: R13.1 R22.2
N$7
  Bottom 0.61: U$1.2 132.94,91.28 131.51,92.71 DOIDE8.A T8.D
N$8
  Bottom 0.61: R.2 LED1.K
N$9
  Bottom 0.61: C2.2 61.82,71.12 Q1.2 61.82,68.58 IC1.12
N$10
  Bottom 0.61: R23.2 R22.1
N$11
  Bottom 0.61: U$2.2 132.78,107.95 132.47,108.27 127.39,108.27 126.75,108.9 DIODE9.A 126.59,109.06 122.94,109.06 T9.D
N$12
  Bottom 0.61: C1.2 64.36,73.66 64.36,82.55 86.27,82.55 86.27,78.42 IC1.32
N$13
  Bottom 0.61: R16.1 R24.2
N$14
  Bottom 0.61: 145.64,107.95 U$2.NP
  Bottom 1.676: RELAY9.2 145.64,107.95
N$15
  Bottom 0.61: C3.2 60.55,63.5 61.82,64.77 Q1.1 61.82,66.04 IC1.13
N$16
  Bottom 0.61: R18.1 R25.2
N$17
  Bottom 0.61: 145.96,58.42 145.8,58.26 U$8.NP
  Bottom 1.676: RELAY6.2 145.96,58.42
N$18
  Bottom 0.61: R26.2 R14.1
N$19
  Bottom 0.61: U$3.2 132.94,124.78 131.99,125.73 126.91,125.73 126.59,126.05 DIODE10.A 126.43,126.05 122.78,126.05 T10.D
N$20
  Bottom 0.61: L2.2 L1.1
N$22
  Bottom 0.61: L2.1 L3.2
N$23
  Bottom 0.61: U$8.2 132.94,58.26 130.4,60.8 128.02,60.8 DIODE6.A 127.7,60.8 124.37,60.8 T6.D
N$24
  Bottom 0.61: 41.19,80.01 OK3.1 42.77,80.01 42.77,73.66 R39.2
N$26
  Bottom 0.61: U$9.2 90.87,25.4 90.87,30.32 DIODE2.A T2.D
N$27
  Bottom 0.61: 145.96,74.93 145.8,74.77 U$10.NP
  Bottom 1.676: RELAY7.2 145.96,74.93
N$28
  Bottom 0.61: 145.96,8.89 145.8,8.73 REL3.NP
  Bottom 1.676: RELAY3.2 145.96,8.89
N$29
  Bottom 0.61: 128.82,76.04 128.02,76.04 DIODE7.A 124.05,76.05 T7.D | 128.82,76.04 131.67,76.04 132.94,74.77 U$10.2 | 128.82,75.88 128.82,76.04
N$31
  Bottom 0.61: 131.04,31.75 U$5.COM
  Bottom 1.676: 131.04,31.75 132.31,33.02 RELAY4.1
N$32
  Bottom 0.61: U$5.2 132.94,25.24 132.78,25.4 DIODE4.A T4.D
N$33
  Bottom 1.676: RELAY9.1 132.15,115.57 130.88,114.3 U$2.COM
N$34
  Bottom 0.61: 131.04,48.26 U$6.COM
  Bottom 1.676: 131.04,48.26 132.31,49.53 RELAY5.1
N$35
  Bottom 0.61: 145.96,91.44 145.8,91.28 U$1.NP
  Bottom 1.676: RELAY8.2 145.96,91.44
N$36
  Bottom 0.61: 145.96,25.4 145.8,25.24
  Bottom 1.676: RELAY4.2 145.96,25.4 | 145.8,25.24 U$5.NP
N$38
  Bottom 1.676: RELAY6.1 152.47,65.25 131.51,65.25 131.04,64.77 U$8.COM
N$39
  Bottom 0.61: 80.87,27.31 U$7.COM
  Bottom 1.676: 80.87,27.31 80.87,6.35 RELAY1.1
N$40
  Bottom 0.61: 131.04,81.28 U$10.COM
  Bottom 1.676: 131.04,81.28 132.31,82.55 RELAY7.1
N$42
  Bottom 0.61: U$6.2 132.94,41.75 130.24,44.45 DIODE5.A T5.D
N$43
  Bottom 0.61: R36.1 R29.2 60.55,106.68 R30.1
N$44
  Bottom 0.61: 145.96,41.91 145.8,41.75 U$6.NP
  Bottom 1.676: RELAY5.2 145.96,41.91
N$45
  Bottom 0.61: R31.1 51.66,110.49 R30.2
N$46
  Bottom 0.61: X12.2 R31.2
N$47
  Bottom 0.61: IC1.40 86.27,96.52 73.89,108.9 73.89,113.03 | 73.89,113.03 73.89,118.75 OK2.4 | R37.1 77.06,124.46 66.9,124.46 66.9,118.75 73.89,113.03
N$48
  Bottom 0.61: U$7.2 74.36,25.4 74.36,30.32 DIODE1.A T1.D
N$49
  Bottom 0.61: R35.2 98.65,125.73 105,125.73 OK1.1
N$50
  Bottom 0.61: RELAY1.2 74.36,5.24 | 74.36,12.54 U$7.NP
  Bottom 1.676: 74.36,5.24 74.36,12.54
N$51
  Bottom 0.61: R34.1 R33.2
N$52
  Bottom 0.61: X13.2 R34.2
N$53
  Bottom 0.61: R32.1 X13.1 OK1.2
N$54
  Bottom 0.61: R32.2 94.68,110.49 | 94.68,110.49 R35.1 | R33.1 95.95,110.33 94.68,110.49
N$55
  Bottom 0.61: R36.2 64.36,125.73 71.98,125.73 OK2.1
N$56
  Bottom 0.61: IC1.2 R14.2
N$57
  Bottom 0.61: R29.1 X12.1 OK2.2
N$58
  Bottom 0.61: 105.64,111.12 107.54,113.03 107.54,120.65 OK1.4 | 105.64,111.12 105.61,94.69 105.61,93.98 IC1.39 | 105.64,111.12 99.92,116.84 91.03,116.84 91.03,133.35 R38.1
N$59
  Bottom 0.61: X14.1 7.53,53.02 18.01,53.02 20.87,55.88 28.49,55.88 39.6,44.77 43.41,44.77 43.73,44.45 51.66,44.45 R44.1
N$60
  Bottom 0.61: IC1.1 R13.2
N$61
  Bottom 0.61: IC1.3 R16.2
N$62
  Bottom 0.61: IC1.4 R17.2
N$63
  Bottom 0.61: IC1.5 R18.2
N$64
  Bottom 0.61: IC1.6 R19.2
N$65
  Bottom 0.61: IC1.7 R20.2
N$66
  Bottom 0.61: IC1.8 R21.2
N$67
  Bottom 0.61: R41.1 40.87,50.8 29.76,61.91 7.21,61.91 X14.2
N$69
  Bottom 0.61: R41.2 R42.1 IC1.19
N$71
  Bottom 0.61: R45.1 29.12,58.42 40.55,46.99 R44.2 44.04,46.99 44.04,60.33 44.36,60.64 65.63,60.64 65.63,55.88 68.17,53.34 IC1.18
N$72
  Bottom 0.61: R42.2 47.85,40.64 45.31,43.18 37.69,43.18 36.42,44.45 27.53,44.45 27.53,46.99 27.37,47.15 21.34,47.15 20.23,49.53 R43.1
N$73
  Bottom 0.61: R45.2 R46.1
NP1
  Bottom 0.61: RELAY2.2 90.87,5.24 | 90.87,12.54 U$9.NP
  Bottom 1.676: 90.87,5.24 90.87,12.54
OUT
  Bottom 0.61: OK3.4 30.07,80.01 | 30.07,80.01 JP1.2 | 30.07,80.01 28.8,81.28 28.8,88.9 R40.1
PC0
  Bottom 0.61: T3.G 122.15,13.34 R3.2 116.43,19.05 116.43,30.48 96.11,50.8 IC1.22
PC1
  Bottom 0.61: T4.G 117.86,28.42 117.86,32.86 R4.2 97.38,53.34 IC1.23
PC2
  Bottom 0.61: T5.G 123.42,51.91 121.67,51.91 R5.2 121.35,52.23 120.24,52.23 116.59,55.88 IC1.24
PC3
  Bottom 0.61: 119.45,59.53 118.34,58.42 | 119.45,59.53 122.31,59.53 T6.G | R6.2 119.29,67.15 119.29,59.69 119.45,59.53 | 118.02,58.42 118.18,58.26 118.34,58.42 | 118.34,58.42 IC1.25
PC4
  Bottom 0.61: 119.13,82.39 R7.2 | IC1.26 93.57,60.96 115,82.39 118.81,82.39 R7.2 | T7.G 118.97,74.93 R7.2
PC5
  Bottom 0.61: T8.G 120.9,93.37 | 120.9,93.37 120.24,93.98 R8.2 | IC1.27 91.03,63.5 120.88,93.34 120.9,93.37
PC6
  Bottom 0.61: 118.02,109.86 R9.2 | T9.G 120.88,110.17 118.34,110.17 R9.2 | 88.81,66.04 IC1.28 91.03,66.04 118.16,93.17 R9.2
PC7
  Bottom 0.61: T10.G 120.88,127.32 118.02,127.32 R10.2 | 88.81,68.9 IC1.29 91.85,68.58 93.68,70.41 93.89,70.48 113.89,90.49 113.89,118.43 117.39,121.92 117.39,127.32 R10.2 | 117.54,127.32 R10.2
PD6
  Bottom 0.61: IC1.20 82.14,39.37 | 82.14,39.37 R1.2 | 82.14,39.37 77.06,39.37 77.06,36.2 T1.G
PD7
  Bottom 0.61: T2.G 96.75,36.2 R2.2 91.03,48.26 IC1.21
R_DAC
  Bottom 0.61: R25.1 R15.1 | R26.1 R24.1 50.23,78.9 50.23,76.36 R25.1 | R20.1 R21.1 58.01,76.2 R25.1 | R23.1 55.47,98.74 54.2,100.01 54.2,101.6 52.93,102.87 40.23,102.87 40.23,91.44 40.39,91.28 45.47,91.28 45.47,88.9 | 45.47,88.9 45.47,83.98 R26.1 | R26.1 37.69,83.82 37.69,77.47 35.76,75.54 R39.1 | R17.1 45.47,88.9
RELAY6
  Bottom 0.61: 145.64,124.78 U$3.NP
  Bottom 1.676: 145.64,124.78 147.87,127 RELAY10.2
RST
  Bottom 0.61: C8.1 D3.A RR.1 42.46,16.19 S1.2 | 42.14,16.51 S1.2 | IC1.9 77.06,76.2 77.22,76.04 77.22,52.23 74.52,49.53 66.9,49.53 66.9,40.64 63.09,36.83 47.85,36.83 44.68,33.81 37.8,33.81 37.69,24.77 37.69,17.78 39.04,16.44 S1.2
RX_BM
  Bottom 0.61: BLUETOOTH.2 13.56,67.31 17.37,63.5 41.5,63.5 R28.1 R27.2
TX_BM
  Bottom 0.61: BLUETOOTH.3 16.1,68.58 20.23,64.45 53.89,64.45 56.11,62.23 70.4,62.23 71.35,63.18 73.25,63.18 IC1.14
TX_MCU
  Bottom 0.61: IC1.15 75.79,58.42 75.79,53.34 74.52,52.07 66.9,52.07 64.36,54.61 64.36,59.37 57.06,59.37 54.84,57.15 R28.2
VCC
  Bottom 0.61: R38.2 113.89,137.31 66.95,137.21 R37.2 64.36,134.62 56.31,134.64 56.31,129.56 56.29,120.65 56.29,116.23 | 51.03,24.13 C9.1 | BLUETOOTH.5 21.82,80.65 21.82,87 21.79,87 | 51.03,24.13 51.03,3.79 51,3.76 21.23,3.76 | 21.79,87 2.13,87 2.13,10.16 4.67,7.62 4.67,3.76 21.23,3.76 | 21.79,87 21.79,116.13 56.08,116.23 56.29,116.23 | 56.29,116.23 56.29,116.03 56.74,115.57 64.36,115.57 66.9,113.03 66.9,99.06 61.82,99.06 61.82,92.71 91.03,92.71 92.3,91.44 92.3,72.39 91.03,71.12 IC1.30 78.33,71.12 78.33,77.47 70.71,77.47 70.71,73.66 IC1.10 | 21.18,3.81 21.23,3.76 | 51.03,24.13 52.3,25.4 L1.2

### Text on the board
Top: vcc